# Altium schematic sheet UNO-R3.SchDoc
size A3; SheetNumber: 1; SheetTotal: 1
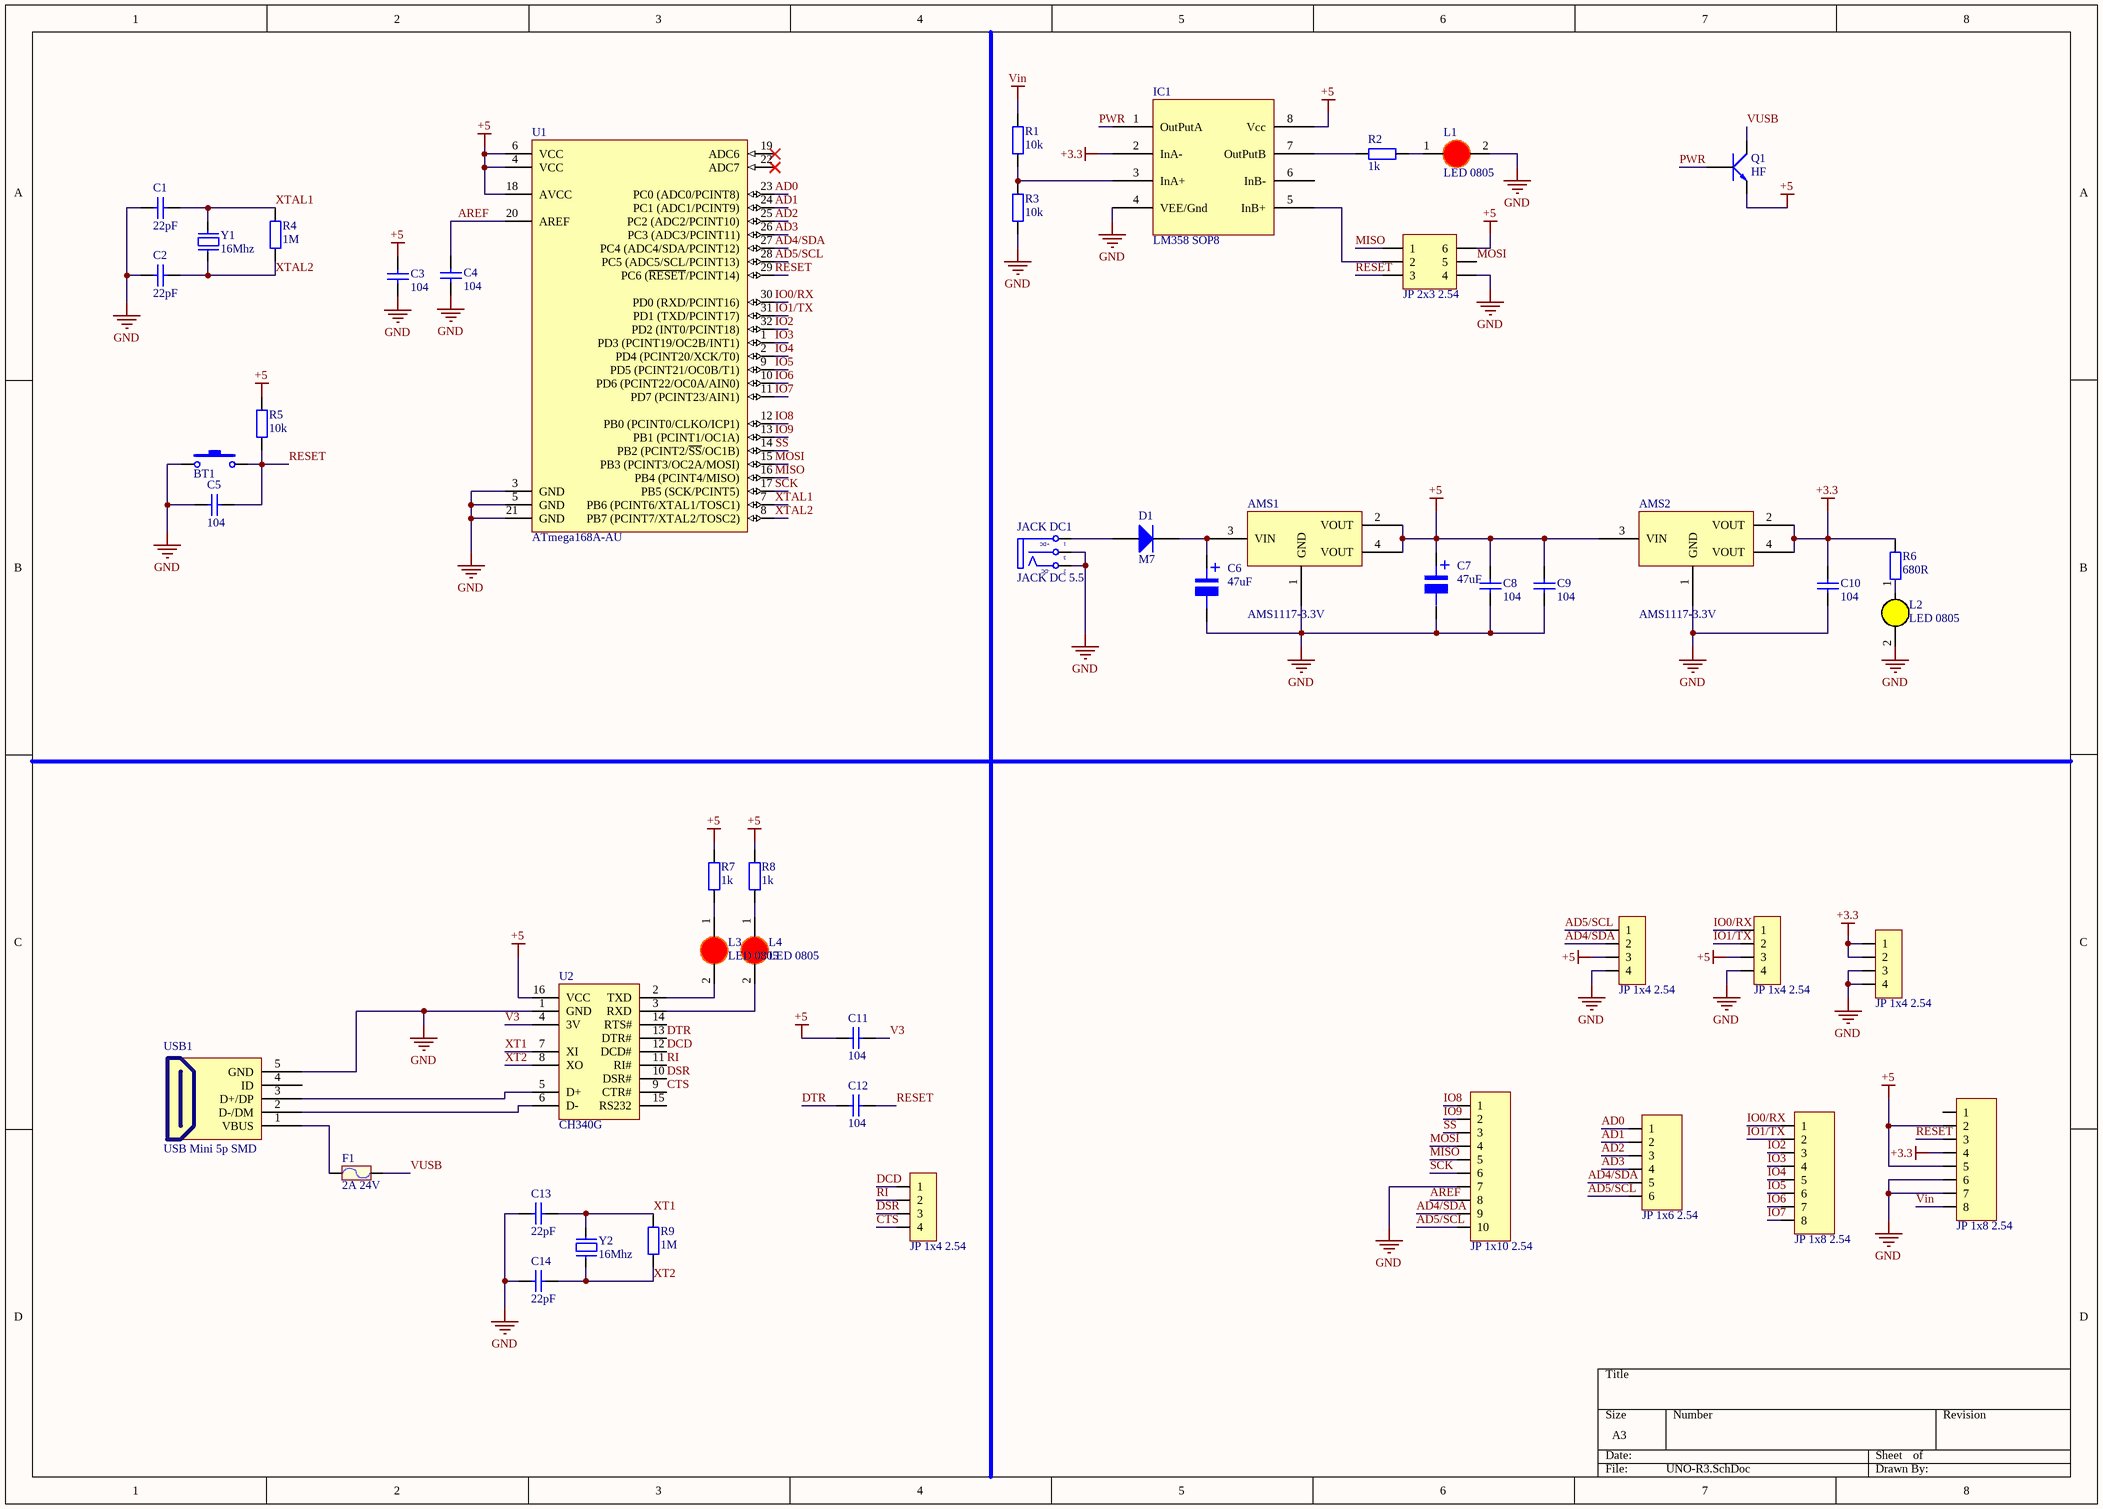
[diagram p0: UNO-R3.SchDoc]

## Parts
AMS1  AMS1117-3.3V  [SOT223]
AMS2  AMS1117-3.3V  [SOT223]
BT1  Nut Nhan 2 Chan SMD 3x6x2.5  [Nut Nhan 2 Chan SMD 3x6x2.5]  (value not drawn)
C1  22pF  [tu 0603]
C2  22pF  [tu 0603]
C3  104  [tu 0603]
C4  104  [tu 0603]
C5  104  [tu 0603]
C6  47uF  [tu nhom 4 (b)]
C7  47uF  [tu nhom 4 (b)]
C8  104  [tu 0402]
C9  104  [tu 0402]
C10  104  [tu 0402]
C11  104  [tu 0603]
C12  104  [tu 0603]
C13  22pF  [tu 0603]
C14  22pF  [tu 0603]
D1  M7  [DIODE SMA]
F1  2A 24V  [Cau chi tu phuc hoi 2A 24V SMD1812]
IC1  LM358 SOP8  [SOP 8]
JACK_DC1  JACK DC 5.5  [JACK DC 5.5]
JP1  JP 2x3 2.54  [JP 2x3 DT]
JP2  JP 1x4 2.54  [JP 1x4 DT]
JP3  JP 1x4 2.54  [JP 1x4 DT]
JP4  JP 1x4 2.54  [JP 1x4 DT]
JP5  JP 1x10 2.54  [JP 1x10 CT]
JP6  JP 1x8 2.54  [JP 1x8 CT]
JP7  JP 1x8 2.54  [JP 1x8 CT]
JP8  JP 1x6 2.54  [JP 1x6 CT]
JP9  JP 1x4 2.54  [JP 1x4 DT]
L1  LED 0805  [LED-0805-Red]
L2  LED 0805  [LED-0805-Yellow]
L3  LED 0805  [LED-0805-Red]
L4  LED 0805  [LED-0805-Red]
Q1  HF  [SOT23]
R1  10k  [tro smd 0603]
R2  1k  [tro smd 0603]
R3  10k  [tro smd 0603]
R4  1M  [tro smd 0805]
R5  10k  [tro smd 0603]
R6  680R  [tro smd 0603]
R7  1k  [tro smd 0603]
R8  1k  [tro smd 0603]
R9  1M  [tro smd 0805]
U1  ATmega168A-AU  [TQFP32]
U2  CH340G  [SO16]
USB1  USB Mini 5p SMD  [USB Mini 5p SMD]
Y1  16Mhz  [Thach Anh 2 chan SMD]
Y2  16Mhz  [Thach Anh 2 chan SMD]

## Nets
+3.3: AMS2.2(VOUT) AMS2.4(VOUT) C10.2 IC1.2(InA-) JP4.1 JP4.2 JP6.4 R6.2
+5: AMS1.2(VOUT) AMS1.4(VOUT) AMS2.3(VIN) C3.1 C7.1 C8.1 C9.1 C11.1 IC1.8(Vcc) JP1.6 JP2.3 JP3.3 JP6.2 JP6.5 Q1.2(E) R5.2 R7.2 R8.2 U1.4(VCC) U1.6(VCC) U1.18(AVCC) U2.16(VCC)
GND: AMS1.1(GND) AMS2.1(GND) BT1.1 C1.2 C2.2 C3.2 C4.2 C5.1 C6.2 C7.2 C8.2 C9.2 C10.1 C13.2 C14.2 IC1.4(VEE/Gnd) JACK_DC1.2(TN) JACK_DC1.3(S) JP1.4 JP2.4 JP3.4 JP4.3 JP4.4 JP5.7 JP6.6 JP6.7 L1.2(K) L2.2(K) R3.1 U1.3(GND) U1.5(GND) U1.21(GND) U2.1(GND) USB1.5(GND)
Vin: JP6.8 R1.2
AD0: JP8.1 U1.23(PC0_(ADC0/PCINT8))
AD1: JP8.2 U1.24(PC1_(ADC1/PCINT9))
AD2: JP8.3 U1.25(PC2_(ADC2/PCINT10))
AD3: JP8.4 U1.26(PC3_(ADC3/PCINT11))
AD4/SDA: JP2.2 JP5.9 JP8.5 U1.27(PC4_(ADC4/SDA/PCINT12))
AD5/SCL: JP2.1 JP5.10 JP8.6 U1.28(PC5_(ADC5/SCL/PCINT13))
AREF: C4.1 JP5.8 U1.20(AREF)
CTS: JP9.4 U2.9(CTR#)
DCD: JP9.1 U2.12(DCD#)
DSR: JP9.3 U2.10(DSR#)
DTR: C12.1 U2.13(DTR#)
IO0/RX: JP3.1 JP7.1 U1.30(PD0_(RXD/PCINT16))
IO1/TX: JP3.2 JP7.2 U1.31(PD1_(TXD/PCINT17))
IO2: JP7.3 U1.32(PD2_(INT0/PCINT18))
IO3: JP7.4 U1.1(PD3_(PCINT19/OC2B/INT1))
IO4: JP7.5 U1.2(PD4_(PCINT20/XCK/T0))
IO5: JP7.6 U1.9(PD5_(PCINT21/OC0B/T1))
IO6: JP7.7 U1.10(PD6_(PCINT22/OC0A/AIN0))
IO7: JP7.8 U1.11(PD7_(PCINT23/AIN1))
IO8: JP5.1 U1.12(PB0_(PCINT0/CLKO/ICP1))
IO9: JP5.2 U1.13(PB1_(PCINT1/OC1A))
MISO: JP1.1 JP5.5 U1.16(PB4_(PCINT4/MISO))
MOSI: JP1.5 JP5.4 U1.15(PB3_(PCINT3/OC2A/MOSI))
PWR: IC1.1(OutPutA) Q1.1(B)
RESET: BT1.2 C5.2 C12.2 JP1.3 JP6.3 R5.1 U1.29(PC6_(~{RESET}/PCINT14))
RI: JP9.2 U2.11(RI#)
SCK: JP5.6 U1.17(PB5_(SCK/PCINT5))
SS: JP5.3 U1.14(PB2_(PCINT2/~{SS}/OC1B))
V3: C11.2 U2.4(3V)
VUSB: F1.1 Q1.3(C)
XT1: C13.1 R9.2 U2.7(XI) Y2.2
XT2: C14.1 R9.1 U2.8(XO) Y2.1
XTAL1: C1.1 R4.2 U1.7(PB6_(PCINT6/XTAL1/TOSC1)) Y1.2
XTAL2: C2.1 R4.1 U1.8(PB7_(PCINT7/XTAL2/TOSC2)) Y1.1
NetAMS1_3: AMS1.3(VIN) C6.1 D1.2(K)
NetD1_1: D1.1(A) JACK_DC1.1(T)
NetF1_2: F1.2 USB1.1(VBUS)
NetIC1_3: IC1.3(InA+) R1.1 R3.2
NetIC1_5: IC1.5(InB+) JP1.2
NetIC1_7: IC1.7(OutPutB) R2.2
NetL1_1: L1.1(A) R2.1
NetL2_1: L2.1(A) R6.1
NetL3_1: L3.1(A) R7.1
NetL3_2: L3.2(K) U2.2(TXD)
NetL4_1: L4.1(A) R8.1
NetL4_2: L4.2(K) U2.3(RXD)
NetU2_5: U2.5(D+) USB1.3(D+/DP)
NetU2_6: U2.6(D-) USB1.2(D-/DM)

Not connected (* = marked no-connect by the designer): IC1 6(InB-); JP6 1; U1 19(ADC6)* 22(ADC7)*; U2 14(RTS#) 15(RS232); USB1 4(ID)

## Notes on the sheet
- (in symbol JACK DC 5.5) +DC; -DC
- (in symbol Tu Nhom 2.2uF 50V) +

## Library data of the parts
AMS1 AMS2 = AMS1117 SMD: Dán; Value: AMS1117-3.3V SOT223; Don_Vi: Con; Ma_Hang: MH000596; Ghi_Chu: *; Kieu_Chan: *; Chung_Loai: Dán
BT1 = Nut Nhan 2 Chan SMD 3x6x2.5: Ma_Hang: MH001036; Ten: Nút Nhấn 2 Chân 3x6x2.5MM SMD
C1 C2 C13 C14 = Tu 0603 22pF 50V 10%: Dán; Don_Vi: Con; So_Chan: 2; Ten_Linh_Kien: Tụ 0603 22pF 50V 10%; Ma_Hang: MH004570; Chung_Loai: Dán; Kieu_Chan: *
C3-C5 C11 C12 = Tu 0603 104 50V 10%: Dán; Don_Vi: Con; So_Chan: 2; Ten_Linh_Kien: Tụ 0603 104-100nF 10% 50V; Ma_Hang: MH004568; Chung_Loai: Dán; Kieu_Chan: *
C6 C7 = Tu Nhom 2.2uF 50V: Dán; Don_Vi: Con; So_Chan: 2; Ten_Linh_Kien: Tụ Nhôm 2.2uF 50V; Ma_Hang: MH004015; Chung_Loai: Dán; Kieu_Chan: *
C8-C10 = Tu 0402 220nF 6.3V 20%: Dán; Don_Vi: Con; So_Chan: 2; Ten_Linh_Kien: Tụ 0402 220nF 6.3V 20%; Ma_Hang: MH008102; Chung_Loai: Dán; Kieu_Chan: *
D1 = Diode M7 ( 4007 ): Dán; Don_Vi: Con; Ten_Linh_Kien: Diode M7 1N4007 SMD 1A 1000V; Ma_Hang: MH000944; Chung_Loai: Dán; Ghi_Chu: *
F1 = Cau chi tu phuc hoi 2A 24V SMD1812: 2A 24V SMD1812; Ma_Hang: MH010033; Ten: Cầu Chì Tự Phục Hồi 2A 24V SMD1812
IC1 = LM358 SOP8: Dán; Ma_Hang: MH000609; Don_Vi: Con; Ten_Linh_Kien: LM358 SOP8; Kieu_Chan: *; Ghi_Chu: *; Chung_Loai: Dán
JACK_DC1 = JACK DC 5.5: Value: Jac DC
JP1 = JP 2x3 2.54 Duc Thang: Cắm; Ten_Linh_Kien: Jump Đôi Đực 2.54MM 2x40P Thẳng 11MM; Don_Vi: Con; Ma_Hang: MH002686; Ghi_Chu: *; Kieu_Chan: *; Chung_Loai: Cắm
JP2-JP4 JP9 = JP 1x4 2.54 Duc Thang: Cắm; Ten_Linh_Kien: Jump Đơn Đực 2.54MM 1x40P Thẳng 11MM; Don_Vi: Con; Ma_Hang: MH000903; Ghi_Chu: *; Kieu_Chan: *; Chung_Loai: Cắm
JP5 = JP 1x10 2.54 Cai Thang: Cắm; Ten_Linh_Kien: Jump Đơn Cái 2.54MM 1x20P Thẳng; Don_Vi: Con; Ma_Hang: MH004006; Ghi_Chu: *; Kieu_Chan: *; Chung_Loai: Cắm
JP6 JP7 = JP 1x8 2.54 Cai Thang: Cắm; Ten_Linh_Kien: Jump Đơn Cái 2.54MM 1x20P Thẳng; Don_Vi: Con; Ma_Hang: MH004006; Ghi_Chu: *; Kieu_Chan: *; Chung_Loai: Cắm
JP8 = JP 1x6 2.54 Cai Thang: Cắm; Ten_Linh_Kien: Jump Đơn Cái 2.54MM 1x20P Thẳng; Don_Vi: Con; Ma_Hang: MH004006; Ghi_Chu: *; Kieu_Chan: *; Chung_Loai: Cắm
L1 L3 L4 = LED 0805 Do: Dán; Don_Vi: Con; Ma_Hang: MH000897; Ten_Linh_Kien: LED 0805 Màu Đỏ (Red); Ghi_Chu: *; Kieu_Chan: *; Chung_Loai: Dán
L2 = LED 0805 Vang: Dán; Don_Vi: Con; Ma_Hang: MH002329; Ten_Linh_Kien: LED 0805 Màu Vàng ( Yellow); Ghi_Chu: *; Kieu_Chan: *; Chung_Loai: Dán
Q1 = C1815 HF SMD: NPN transistor; Value: C9014
R1-R3 R5 R7 R8 = Tro 0603 5% 1k: Dán; Don_Vi: Con; So_Chan: 2; Ten_Linh_Kien: Trở 0603 5% 1k; Ma_Hang: MH006319; Chung_Loai: Dán; Kieu_Chan: *
R4 R9 = Tro 0805 1% 1M: Dán; Don_Vi: Con; So_Chan: 2; Ten_Linh_Kien: Trở 0805 1% 1M; Ma_Hang: MH005469; Chung_Loai: Dán; Kieu_Chan: *
R6 = Tro 0603 1% 680R: Dán; Don_Vi: Con; So_Chan: 2; Ten_Linh_Kien: Trở 0603 1% 680R; Ma_Hang: MH006336; Chung_Loai: Dán; Kieu_Chan: *
U1 = ATmega168A-AU: 8-bit AVR Microcontroller, 16KB Flash, 512 Bytes EEPROM, 1KB SRAM, 32-pin TQFP, Industrial Grade (-40°C to 85°C); Published: 1-Apr-2010; DatasheetVersion: revA, Jan-2010; PackageVersion: revB, Oct-2001; PackageReference: 32A; Publisher: Altium Limited; PackageDescription: 32-Lead, 7x7x1.0 mm Body, 0.8mm Lead Pitch, Thin Profile Plastic Quad Flat Package (TQFP); Supplier 1: Digi-Key; Supplier Part Number 1: ATMEGA168A-AU-ND; Supplier 2: Mouser; Supplier Part Number 2: 556-ATMEGA168A-AU; Code_JEDEC: MS-026-ABA; ComponentLink1Description: Manufacturer Link; ComponentLink1URL: http://www.atmel.com/products/avr/default.asp?; ComponentLink2Description: ATmega48A/48PA/88A/88PA/168A/168PA/328/328P Datasheet; ComponentLink2URL: http://www.atmel.com/dyn/resources/prod_documents/8271.pdf; ComponentLink3Description: ATmega48A/48PA/88A/88PA/168A/168PA/328/328P Summary; ComponentLink3URL: http://www.atmel.com/dyn/resources/prod_documents/8271S.pdf; ComponentLink4Description: Atmel.com Home; ComponentLink4URL: http://www.atmel.com
U2 = CH340G: High and Low Side Driver; Note: Pins 4, 8 and 14 are not connected; Published: 8-Jun-2000; LatestRevisionDate: 04-Mar-2005; LatestRevisionNote: Stylized 3D Model Added.; DatasheetVersion: PD60147J; PackageReference: PDIP14; Publisher: Altium Limited; PackageDescription: DIP; 14 Leads; Row Spacing 7.62 mm; Pitch 2.54 mm; ComponentLink1Description: Manufacturer Link; ComponentLink1URL: http://www.irf.com/; ComponentLink2Description: Datasheet; ComponentLink2URL: http://www.irf.com/product-info/datasheets/data/ir2110.pdf
USB1 = USB Mini 5p SMD: USB Type B; Ten: MiniUSB 5P SMD; Ma_Hang: MH001022
Y1 Y2 = Thach Anh 2 chan SMD: Crystal For all Crystal 2pin.; Value: 4Mhz